# Altium schematic sheet main.SchDoc
size A4; SheetNumber: 1; SheetTotal: 3
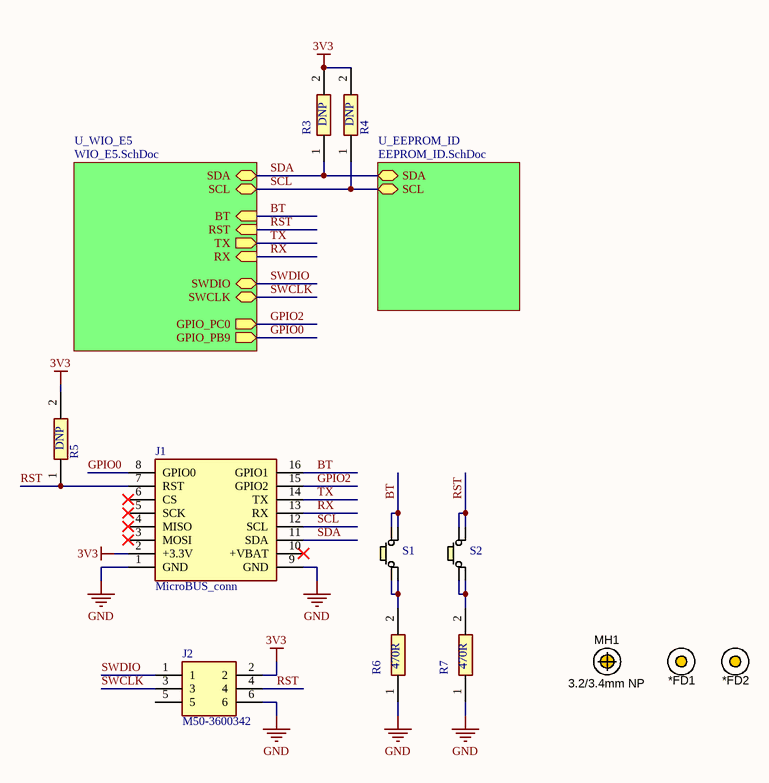
[diagram p0: main.SchDoc]

## Parts
*FD1  FIDUCIAL  [FIDUCIAL]  (value not drawn)
*FD2  FIDUCIAL  [FIDUCIAL]  (value not drawn)
J1  MicroBUS_conn  [MicroBUS_header]
J2  M50-3600342  [HUSSP6W42P127_2X3_381X340X440P]
MH1  3.2/3.4mm NP  [TH_MH3.2/3.4NP]  (no BOM)
R3  DNP  [RESC1005X35N]
R4  DNP  [RESC1005X35N]
R5  DNP  [RESC1005X35N]
R6  470R  [RESC1005X40N]
R7  470R  [RESC1005X40N]
S1  KMR731NG_LFS  [KMR731NGLFS]  (value not drawn)
S2  KMR731NG_LFS  [KMR731NGLFS]  (value not drawn)

## Sub-sheets
U_EEPROM_ID = EEPROM_ID.SchDoc: SDA (bidir), SCL (bidir)
U_WIO_E5 = WIO_E5.SchDoc: SWDIO (bidir), SWCLK (bidir), RST (in), TX (out), RX (in), SCL (bidir), SDA (bidir), BT (in), GPIO_PC0 (out), GPIO_PB9 (out)

## Nets
3V3: J1.2(+3.3V) J2.2 R3.2 R4.2 R5.2
GND: J1.1(GND) J1.9(GND) J2.6 R6.1 R7.1
BT: J1.16(GPIO1) S1.3 S1.4 ; sheet U_WIO_E5/BT
GPIO0: J1.8(GPIO0) ; sheet U_WIO_E5/GPIO_PB9
GPIO2: J1.15(GPIO2) ; sheet U_WIO_E5/GPIO_PC0
RST: J1.7(RST) J2.4 R5.1 S2.3 S2.4 ; sheet U_WIO_E5/RST
RX: J1.13(RX) ; sheet U_WIO_E5/RX
SCL: J1.12(SCL) R4.1 ; sheet U_WIO_E5/SCL, sheet U_EEPROM_ID/SCL
SDA: J1.11(SDA) R3.1 ; sheet U_WIO_E5/SDA, sheet U_EEPROM_ID/SDA
SWCLK: J2.3 ; sheet U_WIO_E5/SWCLK
SWDIO: J2.1 ; sheet U_WIO_E5/SWDIO
TX: J1.14(TX) ; sheet U_WIO_E5/TX
NetR6_2: R6.2 S1.1 S1.2
NetR7_2: R7.2 S2.1 S2.2

Not connected (* = marked no-connect by the designer): *FD1 1; *FD2 1; J1 3(MOSI)* 4(MISO)* 5(SCK)* 6(CS)* 10(+VBAT)*; J2 5

## Notes on the sheet
- Title:
- Date:
- Project:
- Type:
- Schematic
- Variant:
- Revision:
- Sheet
- of
- Author:
- Evžen Šteif
- Size:
- A4

## Library data of the parts
*FD1 *FD2 = MCH_00028: Autor: Lukas Krahulec; Jablotron_Price: 0; Location: LE; Active: 1; Temperature_Min: -55; Temperature_Max: 125; TemperatureRange: Military; Sourcing: None; Generic_replacement: No; LatestRevisionDate: 25.6.2018; Value: Fiducial; PartNumber: MCH_00028; LE_Price: 0; Technology: NOP; Designer: Lukas Krahulec; Librarian: Lukas Krahulec; Manufacturer: LE; FIT: 0; ComponentLink1URL: http://www.logicelements.cz; ComponentLink1Description: Manufacturer Web; Cat1: Fiducial; ROHS: 1; Storage_Count: 0
J1 = MicroBUS_conn: Connector; Manufacturer_Name: Harwin; Manufacturer_Part_Number: M20-9730845; Datasheet Link: https://cdn.harwin.com/pdfs/M20-973.pdf; Height: 9.54mm; Mouser Part Number: 855-M20-9730845; Mouser Price/Stock: https://www.mouser.co.uk/ProductDetail/Harwin/M20-9730845?qs=%252Bk6%2F5FB6qrnRfgIEPS4Dkw%3D%3D
J2 = M50-3600342: Connector; Manufacturer_Name: Harwin; Datasheet Link: https://cdn.harwin.com/pdfs/M50-360.pdf; Manufacturer_Part_Number: M50-3600342; Mouser Part Number: 855-M50-3600342; Mouser Price/Stock: https://www.mouser.co.uk/ProductDetail/Harwin/M50-3600342?qs=uLfVlVfCHH3O1msIjvLxbQ%3D%3D
MH1 = MCH_00037: (Mount Hole 3.2mm); Autor: Lukas Krahulec; Jablotron_Price: 0; Location: LE; Active: 1; Temperature_Min: -55; Temperature_Max: 125; TemperatureRange: Military; Cat1: Mounting Holes; Cat2: Non-Plated; Sourcing: None; Generic_replacement: No; LatestRevisionDate: 24.2.2020; Value: 3.2/3.4mm NP; PartNumber: MCH_00037; LE_Price: 0; Technology: NOP; Designer: Lukas Krahulec; Librarian: Lukas Krahulec; Manufacturer: LE; FIT: 0; ComponentLink1URL: http://www.logicelements.cz; ComponentLink1Description: Manufacturer Web; Cat3: 3.2 mm; ROHS: 1; Storage_Count: 0
R3-R5 = RT0402FRE075K1L: Resistor; Manufacturer_Name: YAGEO; Datasheet Link: https://www.yageo.com/upload/media/product/app/datasheet/rchip/pyu-rt_1-to-0.01_rohs_l.pdf; Height: 0.35mm; Manufacturer_Part_Number: RT0402FRE075K1L; Mouser Part Number: RT0402FRE075K1L; Mouser Price/Stock: https://www.mouser.co.uk/ProductDetail/YAGEO/RT0402FRE07100RL?qs=BXCcY9r%252B08AcvLZjF7vcwQ%3D%3D
R6 R7 = RC0402JR-07470RL: Resistor; Manufacturer_Name: KEMET; Datasheet Link: http://www.yageo.com/documents/recent/PYu-RC0402_51_RoHS_L_6_r.pdf; Height: 0.4mm; Manufacturer_Part_Number: RC0402JR-07470RL; Mouser Part Number: 603-RC0402JR-07470RL; Mouser Price/Stock: https://www.mouser.co.uk/ProductDetail/Yageo/RC0402JR-07470RL/?qs=uM1JSSdPjOBB2HN7BZcUiA%3D%3D; Arrow Part Number: RC0402JR-07470RL; Arrow Price/Stock: https://www.arrow.com/en/products/rc0402jr-07470rl/yageo
S1 S2 = KMR731NG_LFS: Switch; Manufacturer_Name: C & K COMPONENTS; Manufacturer_Part_Number: KMR731NG LFS; Datasheet Link: https://www.ckswitches.com/media/1908/kmr7.pdf; Mouser Part Number: 611-KMR731NGLFS; Mouser Price/Stock: https://www.mouser.com/Search/Refine.aspx?Keyword=611-KMR731NGLFS; Arrow Part Number: KMR731NG LFS; Arrow Price/Stock: https://www.arrow.com/en/products/kmr731nglfs/ck